# EAGLE schematic Pure_VCO_SMD_V2_2_d4f9a5cf-5e05-4fe2-98cd-a19ffc4e3aae (EAGLE 8.3.1)
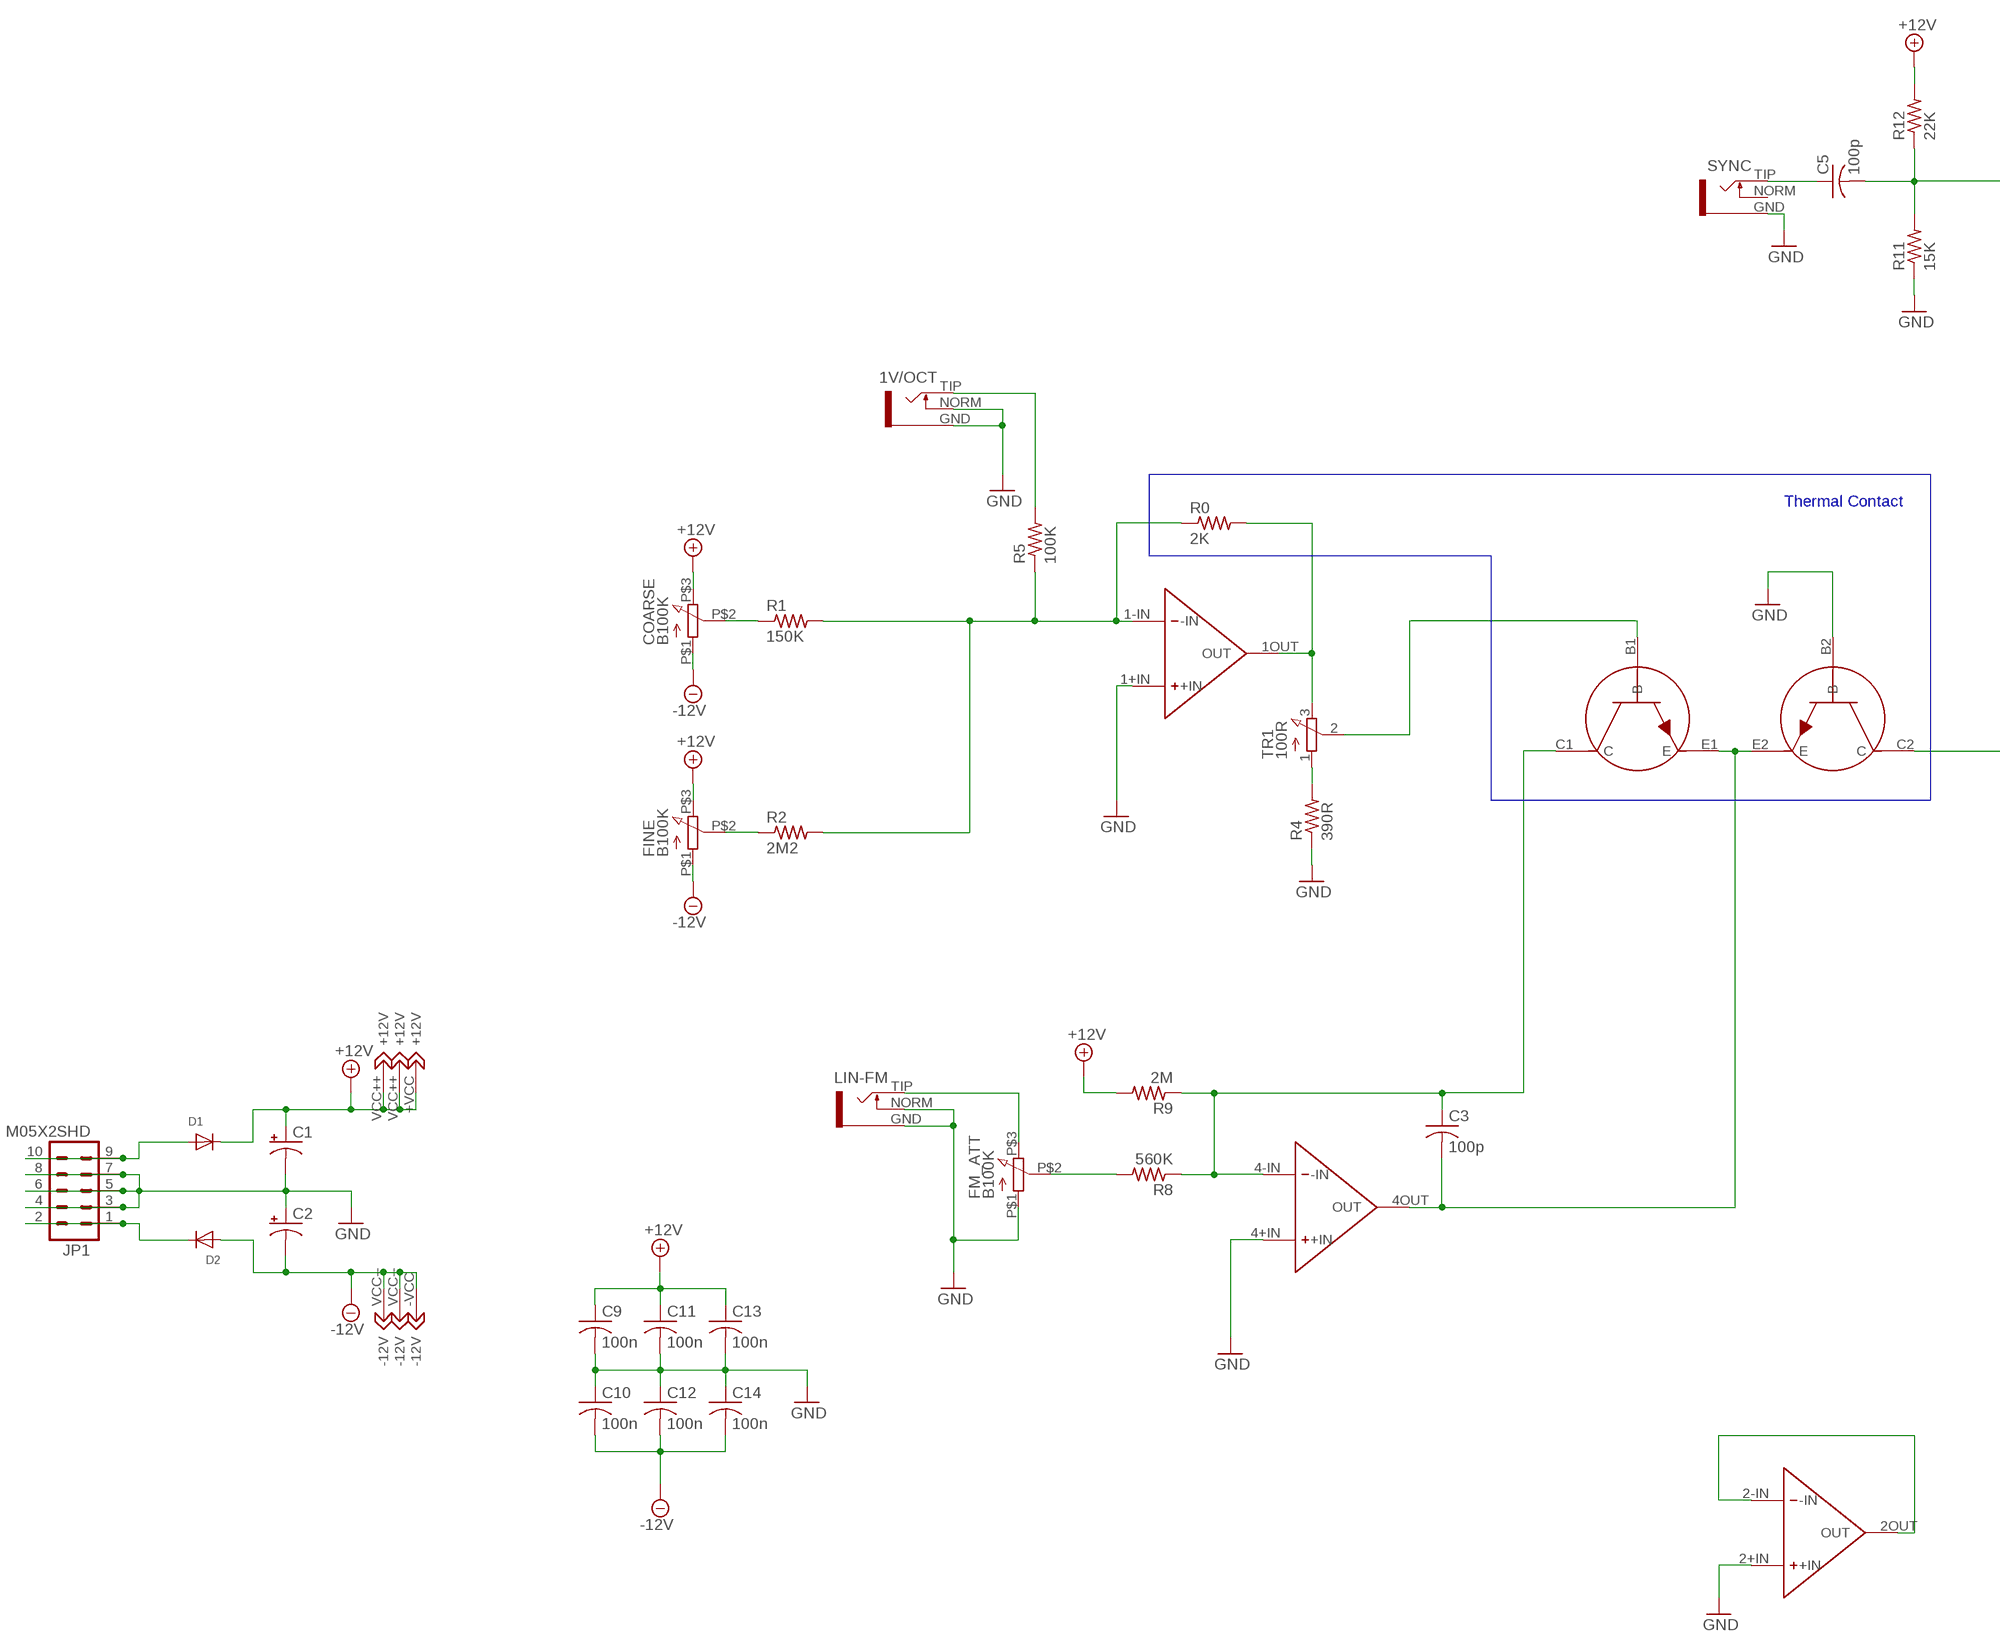
[diagram p0: schematic, sheet 1, part 1 of 2]
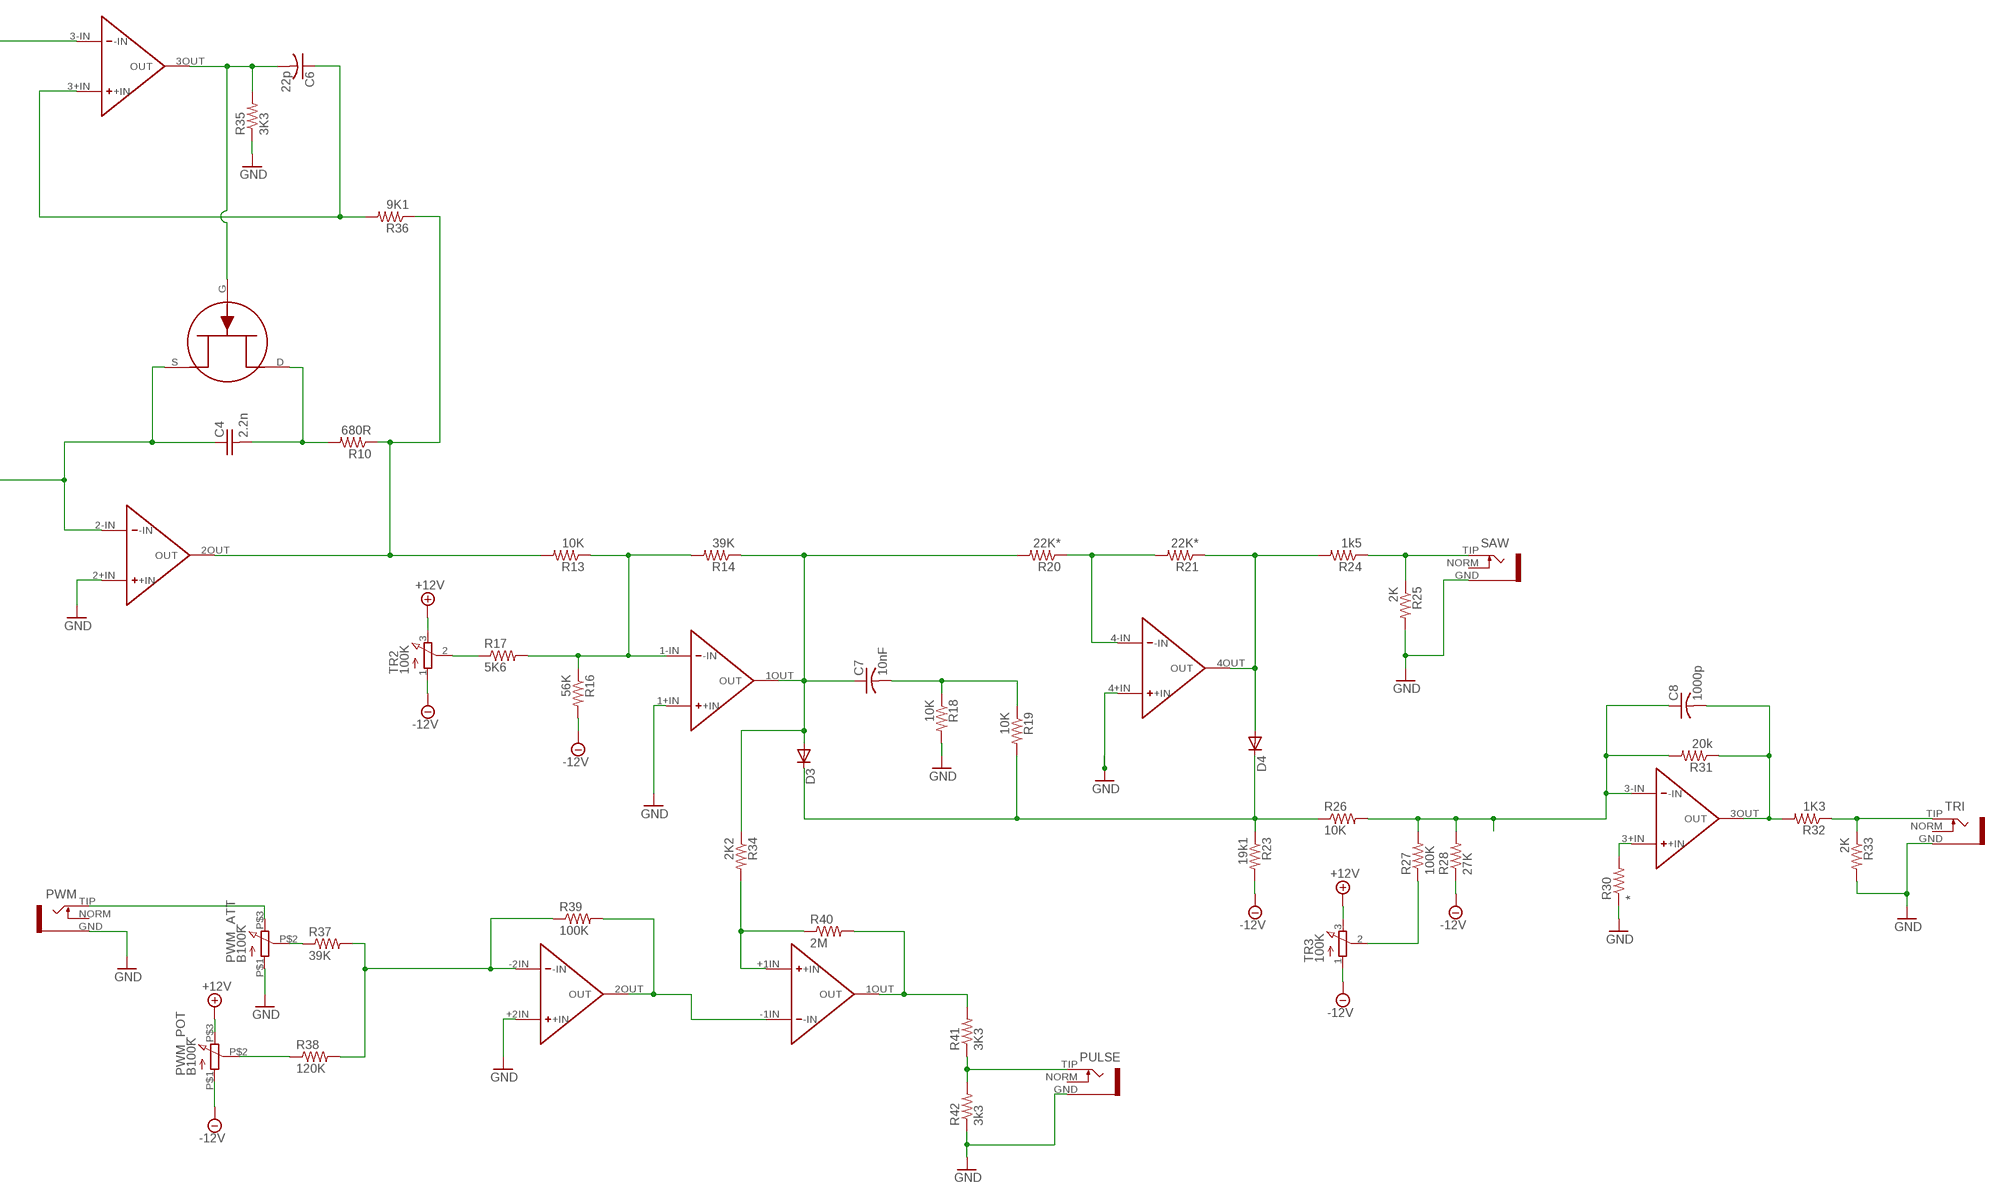
[diagram p1: schematic, sheet 1, part 2 of 2]

## Parts
1V/OCT  S_JACK  [S_JACK]
C1  CPOL-US153CLV-0505  [153CLV-0505]
C2  CPOL-US153CLV-0505  [153CLV-0505]
C3  100p  C-USC0805K  [C0805K]
C4  2.2n  CAP_POLY  [POLY_CAP]
C5  100p  C-USC0805K  [C0805K]
C6  22p  C-USC0805K  [C0805K]
C7  10nF  C-USC0805K  [C0805K]
C8  1000p  C-USC0805K  [C0805K]
C9  100n  C-USC0805K  [C0805K]
C10  100n  C-USC0805K  [C0805K]
C11  100n  C-USC0805K  [C0805K]
C12  100n  C-USC0805K  [C0805K]
C13  100n  C-USC0805K  [C0805K]
C14  100n  C-USC0805K  [C0805K]
COARSE  B100K  Q-POT  [Q-POT]
D1  DIODESMA  [SMADIODE]
D2  DIODESMA  [SMADIODE]
D3  DIODESOD  [SOD-323]
D4  DIODESOD  [SOD-323]
FINE  B100K  Q-POT  [Q-POT]
FM_ATT  B100K  Q-POT  [Q-POT]
JP1  M05X2SHD  [2X5-SHROUDED]
LIN-FM  S_JACK  [S_JACK]
PULSE  S_JACK  [S_JACK]
PWM  S_JACK  [S_JACK]
PWM_ATT  B100K  Q-POT  [Q-POT]
PWM_POT  B100K  Q-POT  [Q-POT]
R0  2K  R_TC  [RESISTOR_TC]
R1  150K  R-US_R0805  [R0805]
R2  2M2  R-US_R0805  [R0805]
R4  390R  R-US_R0805  [R0805]
R5  100K  R-US_R0805  [R0805]
R8  560K  R-US_R0805  [R0805]
R9  2M  R-US_R0805  [R0805]
R10  680R  R-US_R0805  [R0805]
R11  15K  R-US_R0805  [R0805]
R12  22K  R-US_R0805  [R0805]
R13  10K  R-US_R0805  [R0805]
R14  39K  R-US_R0805  [R0805]
R16  56K  R-US_R0805  [R0805]
R17  5K6  R-US_R0805  [R0805]
R18  10K  R-US_R0805  [R0805]
R19  10K  R-US_R0805  [R0805]
R20  22K*  R-US_R0805  [R0805]
R21  22K*  R-US_R0805  [R0805]
R23  19k1  R-US_R0805  [R0805]
R24  1k5  R-US_R0805  [R0805]
R25  2K  R-US_R0805  [R0805]
R26  10K  R-US_R0805  [R0805]
R27  100K  R-US_R0805  [R0805]
R28  27K  R-US_R0805  [R0805]
R30  *  R-US_R0805  [R0805]
R31  20k  R-US_R0805  [R0805]
R32  1K3  R-US_R0805  [R0805]
R33  2K  R-US_R0805  [R0805]
R34  2K2  R-US_R0805  [R0805]
R35  3K3  R-US_R0805  [R0805]
R36  9K1  R-US_R0805  [R0805]
R37  39K  R-US_R0805  [R0805]
R38  120K  R-US_R0805  [R0805]
R39  100K  R-US_R0805  [R0805]
R40  2M  R-US_R0805  [R0805]
R41  3K3  R-US_R0805  [R0805]
R42  3k3  R-US_R0805  [R0805]
SAW  S_JACK  [S_JACK]
SYNC  S_JACK  [S_JACK]
T1  TRANS_PAIR  [TRANS_PAIR]
T2  N_CHN  [N_CHN]
TR1  100R  TRIMMER_TH3  [TRIMMER_TH3]
TR2  100K  TRIM_3269W  [TRIM_3269W]
TR3  100K  TRIM_3269W  [TRIM_3269W]
TRI  S_JACK  [S_JACK]
U1  QUAD_OPAMP  [QUAD_OPAMP]
U2  QUAD_OPAMP  [QUAD_OPAMP]
U3  DUAL_OPAMP  [DUAL_OPAMP]

## Nets
+12V: C1.+ C9.1 C11.1 C13.1 COARSE.P$3 D1.C FINE.P$3 PWM_POT.P$3 R9.2 R12.2 TR2.3 TR3.3 U1.VCC++(+12V) U2.VCC++(+12V) U3.+VCC(+12V)
-12V: C2.- C10.2 C12.2 C14.2 COARSE.P$1 D2.A FINE.P$1 PWM_POT.P$1 R16.2 R23.2 R28.1 TR2.1 TR3.1 U1.VCC--(-12V) U2.VCC--(-12V) U3.-VCC(-12V)
GND: 1V/OCT.GND 1V/OCT.NORM C1.- C2.+ C9.2 C10.1 C11.2 C12.1 C13.2 C14.1 FM_ATT.P$1 JP1.3 JP1.4 JP1.5 JP1.6 JP1.7 JP1.8 LIN-FM.GND LIN-FM.NORM PULSE.GND PWM.GND PWM_ATT.P$1 R4.1 R11.1 R18.2 R25.2 R30.1 R33.2 R35.1 R42.1 SAW.GND SYNC.GND T1.B2(B) TRI.GND U1.1+IN(+IN) U1.2+IN(+IN) U1.4+IN(+IN) U2.1+IN(+IN) U2.2+IN(+IN) U2.4+IN(+IN) U3.+2IN(+IN)
N$1: D1.A JP1.9 JP1.10
N$2: COARSE.P$2 R1.1
N$3: D2.C JP1.1 JP1.2
N$4: R0.1 R1.2 R2.2 R5.1 U1.1-IN(-IN)
N$5: FINE.P$2 R2.1
N$7: R0.2 TR1.3 U1.1OUT(OUT)
N$8: R4.2 TR1.1
N$9: 1V/OCT.TIP R5.2
N$10: T1.B1(B) TR1.2
N$11: C4.2(-) R10.2 T2.D
N$12: C3.1 R8.1 R9.1 T1.C1(C) U1.4-IN(-IN)
N$13: C4.1(+) T1.C2(C) T2.S U1.2-IN(-IN)
N$15: FM_ATT.P$3 LIN-FM.TIP
N$16: C6.1 R36.2 U1.3+IN(+IN)
N$17: FM_ATT.P$2 R8.2
N$18: C3.2 T1.E1(E) T1.E2(E) U1.4OUT(OUT)
N$19: R10.1 R13.2 R36.1 U1.2OUT(OUT)
N$20: C6.2 R35.2 T2.G U1.3OUT(OUT)
N$21: C5.1 SYNC.TIP
N$22: C5.2 R11.2 R12.1 U1.3-IN(-IN)
N$23: R17.1 TR2.2
N$24: R13.1 R14.2 R16.1 R17.2 U2.1-IN(-IN)
N$25: C7.1 D3.2(A) R14.1 R20.2 R34.1 U2.1OUT(OUT)
N$27: R24.1 R25.1 SAW.TIP
N$28: C7.2 R18.1 R19.1
N$29: R27.1 TR3.2
N$30: R20.1 R21.2 U2.4-IN(-IN)
N$31: D4.2(A) R21.1 R24.2 U2.4OUT(OUT)
N$33: D3.1(C) D4.1(C) R19.2 R23.1 R26.1
N$34: C8.1 R26.2 R27.2 R28.2 R31.2 U2.3-IN(-IN)
N$35: R30.2 U2.3+IN(+IN)
N$36: R34.2 R40.1 U3.+1IN(+IN)
N$37: C8.2 R31.1 R32.2 U2.3OUT(OUT)
N$38: R32.1 R33.1 TRI.TIP
N$39: R40.2 R41.2 U3.1OUT(OUT)
N$40: PWM_POT.P$2 R38.1
N$41: PWM.TIP PWM_ATT.P$3
N$42: R37.2 R38.2 R39.1 U3.-2IN(-IN)
N$43: R39.2 U3.2OUT(OUT) U3.-1IN(-IN)
N$44: PULSE.TIP R41.1 R42.2
N$45: U2.2-IN(-IN) U2.2OUT(OUT)
N$46: PWM_ATT.P$2 R37.1
Unconnected: PULSE.NORM PWM.NORM SAW.NORM SYNC.NORM TRI.NORM

## Buses
B$1

## Notes on the sheet
- Thermal Contact

## Library data of the parts
1V/OCT LIN-FM PULSE PWM SAW SYNC TRI = INSTRUO:S_JACK
C1 C2 = rcl:CPOL-US: POLARIZED CAPACITOR, American symbol
C3 C5-C14 = rcl:C-US: CAPACITOR, American symbol
C4 = INSTRUO:CAP_POLY
COARSE FINE FM_ATT PWM_ATT PWM_POT = INSTRUO:Q-POT
D1 D2 = adafruit:DIODE: Diode
D3 D4 = SparkFun-DiscreteSemi:DIODE: Diode
JP1 = SparkFun-Connectors:M05X2: Header 5x2 Standard 10-pin dual row 0.1" header. Commonly used with AVR-ISP. Use with Spark Fun Electronics SKU: PRT-00778
R0 = INSTRUO:R_TC
R1 R2 R4 R5 R8-R14 R16-R21 R23-R28 R30-R42 = rcl:R-US_: RESISTOR, American symbol
T1 = INSTRUO:TRANS_PAIR
T2 = INSTRUO:N_CHN
TR1 = INSTRUO:TRIMMER_TH3
TR2 TR3 = INSTRUO:TRIM_3269W: Manufacturer Part #: 3269W-1-101GLF
U1 U2 = INSTRUO:QUAD_OPAMP
U3 = INSTRUO:DUAL_OPAMP